# Altium schematic sheet RFM12BS.SchDoc
size A4
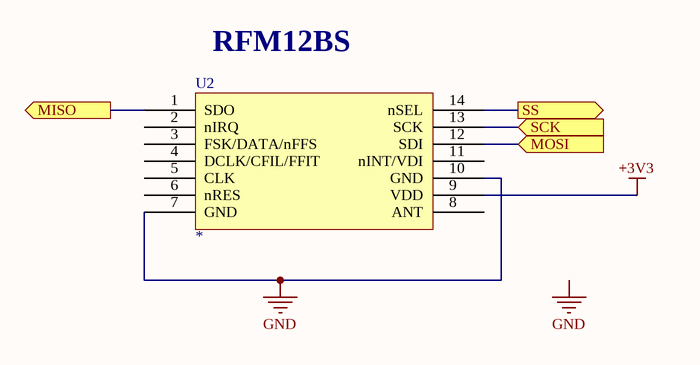
[diagram p0: RFM12BS.SchDoc]

## Parts
U2  *

## Ports
MISO (out), MOSI (in), SCK (in), SS (out)

## Nets
+3V3: U2.9(VDD)
GND: U2.7(GND) U2.10(GND)
MISO: U2.1(SDO) ; port MISO
MOSI: U2.12(SDI) ; port MOSI
SCK: U2.13(SCK) ; port SCK
SS: U2.14(nSEL) ; port SS

Not connected (* = marked no-connect by the designer): U2 2(nIRQ) 3(FSK/DATA/nFFS) 4(DCLK/CFIL/FFIT) 5(CLK) 6(nRES) 8(ANT) 11(nINT/VDI)

## Notes on the sheet
- (near U2) RFM12BS
- Labels drawn without touching a wire or pin: GND

## Library data of the parts
U2 = RFM12BS